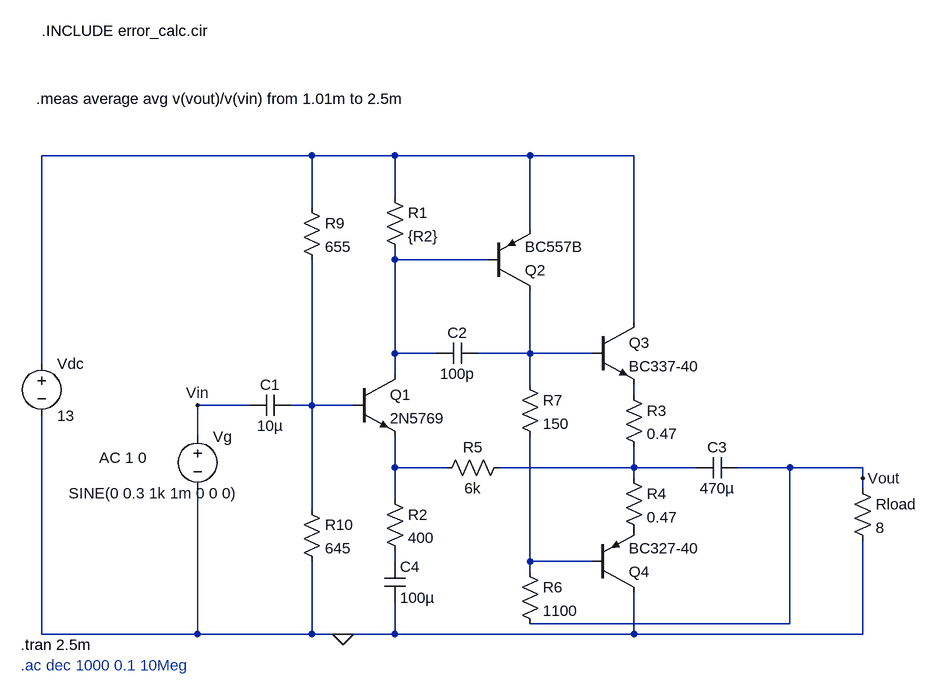
[diagram p0: schematic AmpliRealimentadoSeriesEquivalente.asc]
AmpliRealimentadoSeriesEquivalente.asc, the LTspice schematic file:
Version 4
SHEET 1 2240 680
WIRE 112 -320 -304 -320
WIRE 240 -320 112 -320
WIRE 448 -320 240 -320
WIRE 608 -320 448 -320
WIRE 240 -256 240 -320
WIRE 112 -240 112 -320
WIRE 448 -208 448 -320
WIRE 240 -160 240 -176
WIRE 384 -160 240 -160
WIRE 608 -64 608 -320
WIRE 240 -16 240 -160
WIRE 304 -16 240 -16
WIRE 448 -16 448 -112
WIRE 448 -16 368 -16
WIRE 544 -16 448 -16
WIRE -304 0 -304 -320
WIRE 240 16 240 -16
WIRE 448 32 448 -16
WIRE 608 48 608 32
WIRE 16 64 -64 64
WIRE 112 64 112 -160
WIRE 112 64 80 64
WIRE 176 64 112 64
WIRE -64 112 -64 64
WIRE 240 160 240 112
WIRE 320 160 240 160
WIRE 608 160 608 128
WIRE 608 160 400 160
WIRE 704 160 608 160
WIRE 848 160 768 160
WIRE 960 160 848 160
WIRE 608 176 608 160
WIRE 960 176 960 160
WIRE 960 192 960 176
WIRE 240 208 240 160
WIRE 112 224 112 64
WIRE 240 304 240 288
WIRE 448 304 448 112
WIRE 544 304 448 304
WIRE 448 320 448 304
WIRE 848 400 848 160
WIRE 848 400 448 400
WIRE -304 416 -304 80
WIRE -64 416 -64 192
WIRE -64 416 -304 416
WIRE 112 416 112 304
WIRE 112 416 -64 416
WIRE 160 416 112 416
WIRE 240 416 240 368
WIRE 240 416 160 416
WIRE 608 416 608 352
WIRE 608 416 240 416
WIRE 960 416 960 272
WIRE 960 416 608 416
FLAG 960 176 Vout
FLAG -64 64 Vin
FLAG 160 416 0
SYMBOL voltage -64 96 R0
WINDOW 3 -198 103 Left 2
WINDOW 123 -151 49 Left 2
WINDOW 39 0 0 Left 0
SYMATTR Value SINE(0 0.3 1k 1m 0 0 0)
SYMATTR Value2 AC 1 0
SYMATTR InstName Vg
SYMBOL cap 80 48 R90
WINDOW 0 0 32 VBottom 2
WINDOW 3 32 32 VTop 2
SYMATTR InstName C1
SYMATTR Value 10µ
SYMBOL npn 176 16 R0
SYMATTR InstName Q1
SYMATTR Value 2N5769
SYMBOL res 224 -272 R0
SYMATTR InstName R1
SYMATTR Value {R2}
SYMBOL res 224 192 R0
SYMATTR InstName R2
SYMATTR Value 400
SYMBOL cap 368 -32 R90
WINDOW 0 0 32 VBottom 2
WINDOW 3 32 32 VTop 2
SYMATTR InstName C2
SYMATTR Value 100p
SYMBOL res 944 176 R0
SYMATTR InstName Rload
SYMATTR Value 8
SYMBOL cap 768 144 R90
WINDOW 0 0 32 VBottom 2
WINDOW 3 32 32 VTop 2
SYMATTR InstName C3
SYMATTR Value 470µ
SYMBOL pnp 384 -112 M180
SYMATTR InstName Q2
SYMATTR Value BC557B
SYMBOL res 416 144 R90
WINDOW 0 0 56 VBottom 2
WINDOW 3 32 56 VTop 2
SYMATTR InstName R5
SYMATTR Value 6k
SYMBOL cap 224 304 R0
SYMATTR InstName C4
SYMATTR Value 100µ
SYMBOL voltage -304 -16 R0
SYMATTR InstName Vdc
SYMATTR Value 13
SYMBOL npn 544 -64 R0
SYMATTR InstName Q3
SYMATTR Value BC337-40
SYMBOL res 592 32 R0
SYMATTR InstName R3
SYMATTR Value 0.47
SYMBOL pnp 544 352 M180
SYMATTR InstName Q4
SYMATTR Value BC327-40
SYMBOL res 592 160 R0
SYMATTR InstName R4
SYMATTR Value 0.47
SYMBOL res 432 16 R0
SYMATTR InstName R7
SYMATTR Value 150
SYMBOL res 432 304 R0
SYMATTR InstName R6
SYMATTR Value 1100
SYMBOL res 96 -256 R0
SYMATTR InstName R9
SYMATTR Value 655
SYMBOL res 96 208 R0
SYMATTR InstName R10
SYMATTR Value 645
TEXT -336 432 Left 2 !.tran 2.5m
TEXT -336 464 Left 2 ;.ac dec 1000 0.1 10Meg
TEXT -312 -408 Left 2 !.meas average avg v(vout)/v(vin) from 1.01m to 2.5m
TEXT -304 -512 Left 2 !.INCLUDE error_calc.cir

The netlist it stands for:
* AmpliRealimentadoSeriesEquivalente.asc
Vg Vin 0 SINE(0 0.3 1k 1m 0 0 0) AC 1 0
C1 N005 Vin 10µ
Q1 N002 N005 N006 0 2N5769
R1 N001 N002 {R2}
R2 N006 N008 400
C2 N003 N002 100p
Rload Vout 0 8
C3 Vout N007 470µ
Q2 N003 N002 N001 0 BC557B
R5 N007 N006 6k
C4 N008 0 100µ
Vdc N001 0 13
Q3 N001 N003 N004 0 BC337-40
R3 N004 N007 0.47
Q4 0 N009 P001 0 BC327-40
R4 N007 P001 0.47
R7 N003 N009 150
R6 N009 Vout 1100
R9 N001 N005 655
R10 N005 0 645
.model NPN NPN
.model PNP PNP
.lib standard.bjt
.tran 2.5m
* .ac dec 1000 0.1 10Meg
.meas average avg v(vout)/v(vin) from 1.01m to 2.5m
.INCLUDE error_calc.cir
.backanno
.end